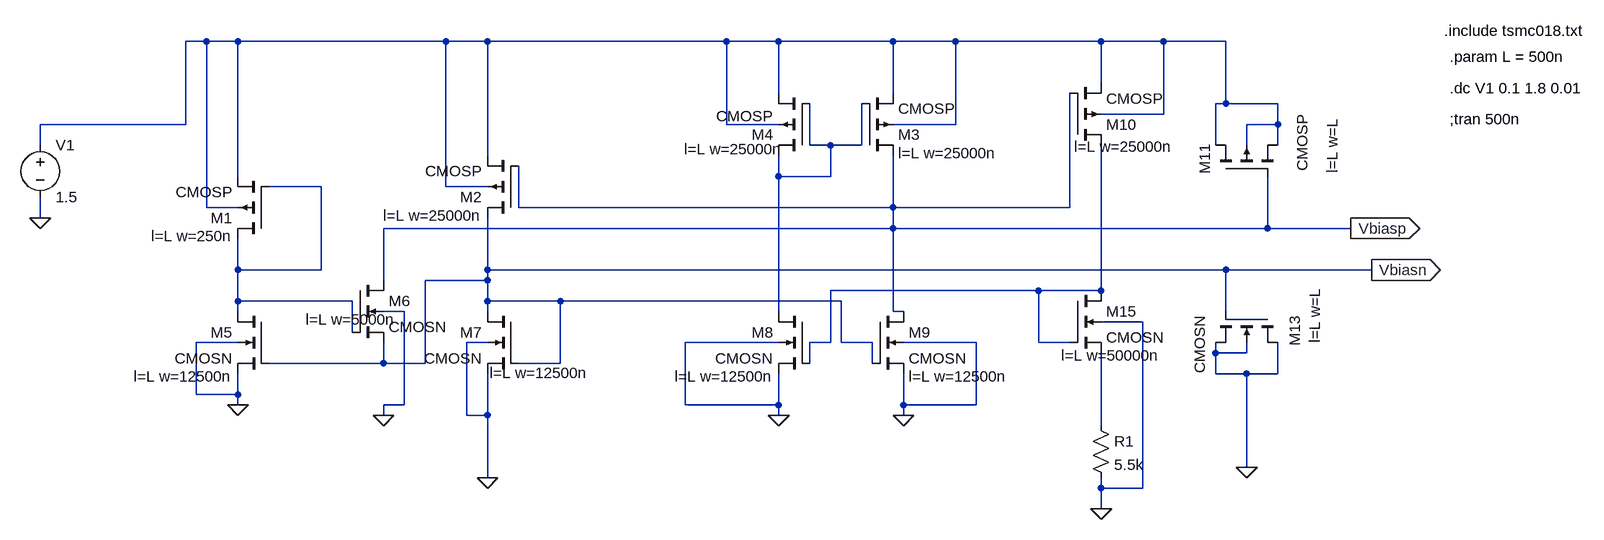
[diagram p0: schematic CurrentReferrence.asc]
CurrentReferrence.asc, the LTspice schematic file:
Version 4
SHEET 1 2132 680
WIRE -48 -368 -80 -368
WIRE 0 -368 -48 -368
WIRE 320 -368 0 -368
WIRE 384 -368 320 -368
WIRE 752 -368 384 -368
WIRE 832 -368 752 -368
WIRE 1008 -368 832 -368
WIRE 1104 -368 1008 -368
WIRE 1328 -368 1104 -368
WIRE 1424 -368 1328 -368
WIRE 1520 -368 1424 -368
WIRE 1328 -304 1328 -368
WIRE 832 -288 832 -368
WIRE 1008 -288 1008 -368
WIRE 1520 -272 1520 -368
WIRE 1520 -272 1504 -272
WIRE 1600 -272 1520 -272
WIRE 1424 -256 1424 -368
WIRE 1424 -256 1328 -256
WIRE -80 -240 -80 -368
WIRE -80 -240 -304 -240
WIRE 752 -240 752 -368
WIRE 832 -240 752 -240
WIRE 1104 -240 1104 -368
WIRE 1104 -240 1008 -240
WIRE 1600 -240 1600 -272
WIRE 1600 -240 1552 -240
WIRE -304 -208 -304 -240
WIRE 880 -208 880 -272
WIRE 912 -208 880 -208
WIRE 960 -208 960 -272
WIRE 960 -208 912 -208
WIRE 1504 -208 1504 -272
WIRE 1552 -208 1552 -240
WIRE 1600 -208 1600 -240
WIRE 384 -192 384 -368
WIRE 0 -160 0 -368
WIRE 832 -160 832 -192
WIRE 912 -160 912 -208
WIRE 912 -160 832 -160
WIRE 128 -144 48 -144
WIRE 320 -144 320 -368
WIRE 384 -144 320 -144
WIRE -48 -112 -48 -368
WIRE 0 -112 -48 -112
WIRE 432 -112 432 -176
WIRE 1008 -112 1008 -192
WIRE 1008 -112 432 -112
WIRE 1280 -112 1280 -288
WIRE 1280 -112 1008 -112
WIRE -304 -96 -304 -128
WIRE 1008 -80 1008 -112
WIRE 1008 -80 224 -80
WIRE 1584 -80 1584 -160
WIRE 1584 -80 1008 -80
WIRE 1712 -80 1584 -80
WIRE 0 -16 0 -64
WIRE 128 -16 128 -144
WIRE 128 -16 0 -16
WIRE 384 -16 384 -96
WIRE 1520 -16 384 -16
WIRE 1744 -16 1520 -16
WIRE 224 0 224 -80
WIRE 384 0 384 -16
WIRE 384 0 288 0
WIRE 1232 16 912 16
WIRE 1328 16 1328 -208
WIRE 1328 16 1232 16
WIRE 0 32 0 -16
WIRE 176 32 0 32
WIRE 384 32 384 0
WIRE 496 32 384 32
WIRE 928 32 496 32
WIRE 0 48 0 32
WIRE 256 48 224 48
WIRE 384 48 384 32
WIRE 832 48 832 -160
WIRE 1008 48 1008 -80
WIRE 1024 48 1008 48
WIRE 1520 48 1520 -16
WIRE 1392 64 1328 64
WIRE 176 80 176 32
WIRE 0 96 -64 96
WIRE 384 96 352 96
WIRE 832 96 688 96
WIRE 912 96 912 16
WIRE 912 96 880 96
WIRE 928 96 928 32
WIRE 976 96 928 96
WIRE 1136 96 1024 96
WIRE 1232 96 1232 16
WIRE 1280 96 1232 96
WIRE 1504 112 1504 96
WIRE 1552 112 1552 96
WIRE 1552 112 1504 112
WIRE 224 128 224 96
WIRE 224 128 48 128
WIRE 288 128 288 0
WIRE 288 128 224 128
WIRE 496 128 496 32
WIRE 496 128 432 128
WIRE 880 128 880 96
WIRE 976 128 976 96
WIRE 1504 144 1504 112
WIRE 1552 144 1504 144
WIRE 1600 144 1600 96
WIRE 1600 144 1552 144
WIRE -64 176 -64 96
WIRE 0 176 0 144
WIRE 0 176 -64 176
WIRE 0 192 0 176
WIRE 256 192 256 48
WIRE 256 192 224 192
WIRE 688 192 688 96
WIRE 832 192 832 144
WIRE 832 192 688 192
WIRE 1024 192 1024 144
WIRE 1136 192 1136 96
WIRE 1136 192 1024 192
WIRE 224 208 224 192
WIRE 352 208 352 96
WIRE 384 208 384 144
WIRE 384 208 352 208
WIRE 832 208 832 192
WIRE 1024 208 1024 192
WIRE 1328 224 1328 112
WIRE 1552 288 1552 144
WIRE 384 304 384 208
WIRE 1328 320 1328 304
WIRE 1392 320 1392 64
WIRE 1392 320 1328 320
WIRE 1328 352 1328 320
FLAG 0 192 0
FLAG -304 -96 0
FLAG 384 304 0
FLAG 832 208 0
FLAG 1024 208 0
FLAG 1328 352 0
FLAG 1552 288 0
FLAG 1712 -80 Vbiasp
IOPIN 1712 -80 Out
FLAG 1744 -16 Vbiasn
IOPIN 1744 -16 Out
FLAG 224 208 0
SYMBOL pmos4 48 -64 R180
WINDOW 123 56 4 Left 2
SYMATTR Value2 l=L w=250n
SYMATTR InstName M1
SYMATTR Value CMOSP
SYMBOL pmos4 432 -96 R180
WINDOW 123 56 4 Left 2
SYMATTR Value2 l=L w=25000n
SYMATTR InstName M2
SYMATTR Value CMOSP
SYMBOL pmos4 960 -192 M180
WINDOW 123 56 4 Left 2
SYMATTR Value2 l=L w=25000n
SYMATTR InstName M3
SYMATTR Value CMOSP
SYMBOL pmos4 880 -192 R180
WINDOW 3 56 61 Left 2
WINDOW 123 41 10 Left 2
SYMATTR Value CMOSP
SYMATTR Value2 l=L w=25000n
SYMATTR InstName M4
SYMBOL nmos4 48 48 M0
WINDOW 123 56 100 Left 2
SYMATTR Value2 l=L w=12500n
SYMATTR InstName M5
SYMATTR Value CMOSN
SYMBOL nmos4 176 0 R0
WINDOW 123 -72 60 Left 2
SYMATTR Value2 l=L w=5000n
SYMATTR InstName M6
SYMATTR Value CMOSN
SYMBOL nmos4 432 48 M0
WINDOW 123 -108 95 Left 2
SYMATTR Value2 l=L w=12500n
SYMATTR InstName M7
SYMATTR Value CMOSN
SYMBOL nmos4 880 48 M0
WINDOW 123 56 100 Left 2
SYMATTR Value2 l=L w=12500n
SYMATTR InstName M8
SYMATTR Value CMOSN
SYMBOL nmos4 976 48 R0
WINDOW 123 56 100 Left 2
SYMATTR Value2 l=L w=12500n
SYMATTR InstName M9
SYMATTR Value CMOSN
SYMBOL voltage -304 -224 R0
WINDOW 123 0 0 Left 0
WINDOW 39 0 0 Left 0
SYMATTR InstName V1
SYMATTR Value 1.5
SYMBOL pmos4 1280 -208 M180
WINDOW 123 7 -2 Left 2
SYMATTR Value2 l=L w=25000n
SYMATTR InstName M10
SYMATTR Value CMOSP
SYMBOL pmos4 1504 -160 R270
WINDOW 0 3 -16 Left 2
WINDOW 3 8 134 Left 2
WINDOW 123 5 180 Left 2
SYMATTR InstName M11
SYMATTR Value CMOSP
SYMATTR Value2 l=L w=L
SYMBOL nmos4 1600 48 R90
WINDOW 0 6 -26 Left 2
WINDOW 3 6 120 Left 2
WINDOW 123 -36 -57 Left 2
SYMATTR InstName M13
SYMATTR Value CMOSN
SYMATTR Value2 l=L w=L
SYMBOL nmos4 1280 16 R0
WINDOW 123 -13 100 Left 2
SYMATTR Value2 l=L w=50000n
SYMATTR InstName M15
SYMATTR Value CMOSN
SYMBOL res 1312 208 R0
SYMATTR InstName R1
SYMATTR Value 5.5k
TEXT 1856 -384 Left 2 !.include tsmc018.txt
TEXT 1864 -344 Left 2 !.param L = 500n
TEXT 1864 -296 Left 2 !.dc V1 0.1 1.8 0.01
TEXT 1864 -248 Left 2 !;tran 500n

The netlist it stands for:
* CurrentReferrence.asc
M1 N003 N003 N001 N001 CMOSP l=L w=250n
M2 Vbiasn Vbiasp N001 N001 CMOSP l=L w=25000n
M3 Vbiasp N002 N001 N001 CMOSP l=L w=25000n
M4 N002 N002 N001 N001 CMOSP l=L w=25000n
M5 N003 Vbiasn 0 0 CMOSN l=L w=12500n
M6 Vbiasp N003 Vbiasn 0 CMOSN l=L w=5000n
M7 Vbiasn Vbiasn 0 0 CMOSN l=L w=12500n
M8 N002 N004 0 0 CMOSN l=L w=12500n
M9 Vbiasp Vbiasn 0 0 CMOSN l=L w=12500n
V1 N001 0 1.5
M10 N004 Vbiasp N001 N001 CMOSP l=L w=25000n
M11 N001 Vbiasp N001 N001 CMOSP l=L w=L
M13 0 Vbiasn 0 0 CMOSN l=L w=L
M15 N004 N004 N005 0 CMOSN l=L w=50000n
R1 N005 0 5.5k
.model NMOS NMOS
.model PMOS PMOS
.lib standard.mos
.include tsmc018.txt
.param L = 500n
.dc V1 0.1 1.8 0.01
;tran 500n
.backanno
.end